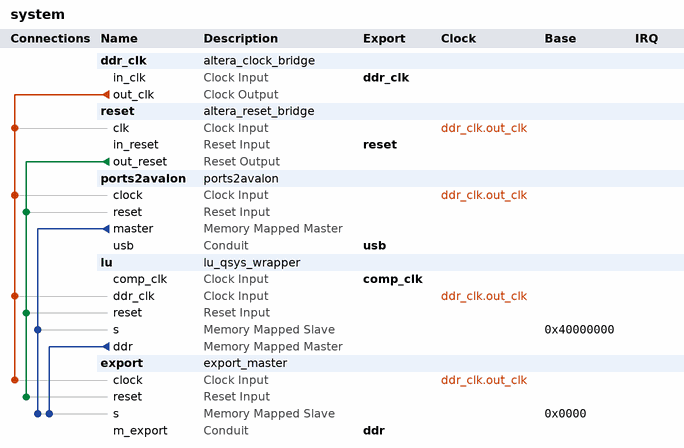
[diagram p0: system contents]
# Platform Designer (Qsys) system system
# Parameters at their usual value, and those the tool derives, are not listed.
package require -exact qsys 11.1
create_system system
set_project_property DEVICE_FAMILY STRATIXIV

add_instance ddr_clk altera_clock_bridge 11.1
set_instance_parameter_value ddr_clk DERIVED_CLOCK_RATE 0
set_instance_parameter_value ddr_clk EXPLICIT_CLOCK_RATE 200000000

add_instance reset altera_reset_bridge 11.1
set_instance_parameter_value reset ACTIVE_LOW_RESET 0
set_instance_parameter_value reset SYNCHRONOUS_EDGES deassert

add_instance ports2avalon ports2avalon 1.0
set_instance_parameter_value ports2avalon ADDRESS_WIDTH 32

add_instance lu lu_qsys_wrapper 2.0
set_instance_parameter_value lu BURSTLEN 6
set_instance_parameter_value lu ADDRESS_WIDTH 30

add_instance export export_master 1.0
set_instance_parameter_value export DWIDTH 256
set_instance_parameter_value export AWIDTH_S 25
set_instance_parameter_value export AWIDTH_M 30
set_instance_parameter_value export BYTEWIDTH 32
set_instance_parameter_value export BURSTWIDTH 6

# connections
add_connection ddr_clk.out_clk export.clock clock
add_connection ddr_clk.out_clk lu.ddr_clk clock
add_connection ddr_clk.out_clk ports2avalon.clock clock
add_connection ddr_clk.out_clk reset.clk clock
add_connection reset.out_reset export.reset reset
add_connection reset.out_reset lu.reset reset
add_connection reset.out_reset ports2avalon.reset reset
add_connection lu.ddr export.s avalon
set_connection_parameter_value lu.ddr/export.s baseAddress 0x0000
add_connection ports2avalon.master export.s avalon
set_connection_parameter_value ports2avalon.master/export.s baseAddress 0x0000
add_connection ports2avalon.master lu.s avalon
set_connection_parameter_value ports2avalon.master/lu.s baseAddress 0x40000000

# exported interfaces
add_interface ddr conduit end
set_interface_property ddr EXPORT_OF export.m_export
add_interface usb conduit end
set_interface_property usb EXPORT_OF ports2avalon.usb
add_interface ddr_clk clock sink
set_interface_property ddr_clk EXPORT_OF ddr_clk.in_clk
add_interface reset reset sink
set_interface_property reset EXPORT_OF reset.in_reset
add_interface comp_clk clock sink
set_interface_property comp_clk EXPORT_OF lu.comp_clk

save_system system.qsys
